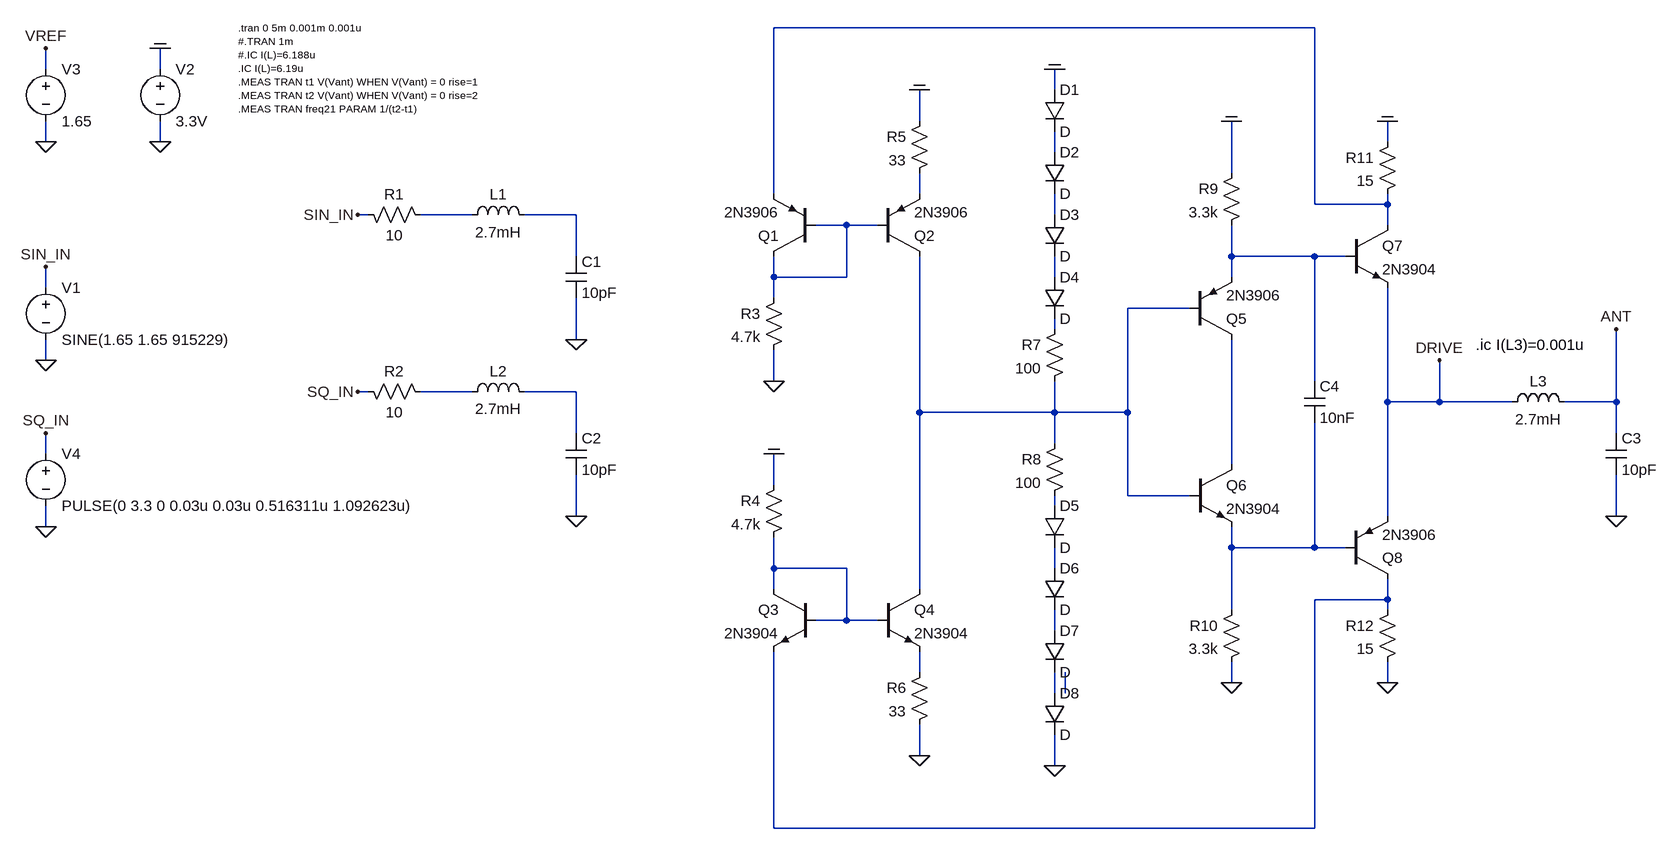
[diagram p0: schematic 2021_current_sensing_current_mirrors_oscillator_03.asc]
2021_current_sensing_current_mirrors_oscillator_03.asc, the LTspice schematic file:
Version 4
SHEET 1 8068 8692
WIRE 1504 -272 672 -272
WIRE -448 -208 -448 -240
WIRE -272 -208 -272 -240
WIRE 1104 -176 1104 -208
WIRE 896 -128 896 -176
WIRE -448 -96 -448 -128
WIRE -272 -96 -272 -128
WIRE 1616 -96 1616 -128
WIRE 1104 -80 1104 -112
WIRE 1376 -48 1376 -128
WIRE 672 -16 672 -272
WIRE 896 -16 896 -48
WIRE 1504 0 1504 -272
WIRE 1616 0 1616 -16
WIRE 1616 0 1504 0
WIRE 48 16 32 16
WIRE 208 16 128 16
WIRE 368 16 288 16
WIRE 1104 16 1104 -16
WIRE 784 32 736 32
WIRE 832 32 784 32
WIRE 1616 32 1616 0
WIRE 368 80 368 16
WIRE 1376 80 1376 32
WIRE 1504 80 1376 80
WIRE 1552 80 1504 80
WIRE 672 112 672 80
WIRE 784 112 784 32
WIRE 784 112 672 112
WIRE 1104 112 1104 80
WIRE 1376 112 1376 80
WIRE -448 128 -448 96
WIRE 672 144 672 112
WIRE 1312 160 1216 160
WIRE 1104 192 1104 176
WIRE 368 208 368 144
WIRE -448 240 -448 208
WIRE 672 272 672 224
WIRE 1504 272 1504 80
WIRE 48 288 32 288
WIRE 208 288 128 288
WIRE 368 288 288 288
WIRE 1616 304 1616 128
WIRE 1696 304 1696 240
WIRE 1696 304 1616 304
WIRE 1808 304 1696 304
WIRE 1968 304 1968 192
WIRE 1968 304 1888 304
WIRE 896 320 896 80
WIRE 1104 320 1104 272
WIRE 1104 320 896 320
WIRE 1216 320 1216 160
WIRE 1216 320 1104 320
WIRE 368 352 368 288
WIRE 1968 352 1968 304
WIRE 1104 368 1104 320
WIRE -448 384 -448 352
WIRE 1376 400 1376 208
WIRE 672 432 672 384
WIRE 1216 448 1216 320
WIRE 1312 448 1216 448
WIRE 1104 464 1104 448
WIRE 368 480 368 416
WIRE 1616 480 1616 304
WIRE 1968 480 1968 416
WIRE -448 496 -448 464
WIRE 1376 528 1376 496
WIRE 1504 528 1504 336
WIRE 1504 528 1376 528
WIRE 1552 528 1504 528
WIRE 672 560 672 512
WIRE 784 560 672 560
WIRE 1104 560 1104 528
WIRE 672 592 672 560
WIRE 896 592 896 320
WIRE 1616 608 1616 576
WIRE 1616 608 1504 608
WIRE 1376 624 1376 528
WIRE 1616 624 1616 608
WIRE 784 640 784 560
WIRE 784 640 736 640
WIRE 832 640 784 640
WIRE 1104 656 1104 624
WIRE 896 720 896 688
WIRE 1376 736 1376 704
WIRE 1616 736 1616 704
WIRE 1104 752 1104 720
WIRE 1120 752 1120 720
WIRE 896 848 896 800
WIRE 1104 864 1104 816
WIRE 672 960 672 688
WIRE 1504 960 1504 608
WIRE 1504 960 672 960
FLAG -448 240 0
FLAG 368 208 0
FLAG -272 -96 0
FLAG -272 -240 COM
FLAG -448 -96 0
FLAG -448 -240 VREF
FLAG -448 96 SIN_IN
FLAG 32 16 SIN_IN
FLAG -448 496 0
FLAG -448 352 SQ_IN
FLAG 368 480 0
FLAG 32 288 SQ_IN
FLAG 672 384 COM
FLAG 672 272 0
FLAG 896 848 0
FLAG 896 -176 COM
FLAG 1376 736 0
FLAG 1376 -128 COM
FLAG 1616 -128 COM
FLAG 1616 736 0
FLAG 1968 480 0
FLAG 1104 864 0
FLAG 1104 -208 COM
FLAG 1696 240 DRIVE
FLAG 1968 192 ANT
SYMBOL voltage -448 112 R0
WINDOW 123 0 0 Left 0
WINDOW 39 0 0 Left 0
SYMATTR InstName V1
SYMATTR Value SINE(1.65 1.65 915229)
SYMBOL ind 192 32 R270
WINDOW 0 32 56 VTop 2
WINDOW 3 5 56 VBottom 2
SYMATTR InstName L1
SYMATTR Value 2.7mH
SYMATTR SpiceLine Rser=120 Cpar=1.2pF
SYMBOL cap 352 80 R0
SYMATTR InstName C1
SYMATTR Value 10pF
SYMBOL res 144 32 M270
WINDOW 0 32 56 VTop 2
WINDOW 3 0 56 VBottom 2
SYMATTR InstName R1
SYMATTR Value 10
SYMBOL voltage -272 -224 R0
WINDOW 123 0 0 Left 2
WINDOW 39 0 0 Left 2
SYMATTR InstName V2
SYMATTR Value 3.3V
SYMBOL voltage -448 -224 R0
WINDOW 123 0 0 Left 0
WINDOW 39 0 0 Left 0
SYMATTR InstName V3
SYMATTR Value 1.65
SYMBOL voltage -448 368 R0
WINDOW 123 0 0 Left 0
WINDOW 39 0 0 Left 0
SYMATTR InstName V4
SYMATTR Value PULSE(0 3.3 0 0.03u 0.03u 0.516311u 1.092623u)
SYMBOL ind 192 304 R270
WINDOW 0 32 56 VTop 2
WINDOW 3 5 56 VBottom 2
SYMATTR InstName L2
SYMATTR Value 2.7mH
SYMATTR SpiceLine Rser=120 Cpar=1.2pF
SYMBOL cap 352 352 R0
SYMATTR InstName C2
SYMATTR Value 10pF
SYMBOL res 144 304 M270
WINDOW 0 32 56 VTop 2
WINDOW 3 0 56 VBottom 2
SYMATTR InstName R2
SYMATTR Value 10
SYMBOL npn 832 592 R0
SYMATTR InstName Q4
SYMATTR Value 2N3904
SYMBOL npn 736 592 M0
SYMATTR InstName Q3
SYMATTR Value 2N3904
SYMBOL pnp 832 80 M180
SYMATTR InstName Q2
SYMATTR Value 2N3906
SYMBOL pnp 736 80 R180
SYMATTR InstName Q1
SYMATTR Value 2N3906
SYMBOL res 688 128 M0
WINDOW 0 36 40 Left 2
WINDOW 3 36 76 Left 2
SYMATTR InstName R3
SYMATTR Value 4.7k
SYMBOL res 688 416 M0
WINDOW 0 36 40 Left 2
WINDOW 3 36 76 Left 2
SYMATTR InstName R4
SYMATTR Value 4.7k
SYMBOL res 912 704 M0
WINDOW 0 36 40 Left 2
WINDOW 3 36 76 Left 2
SYMATTR InstName R6
SYMATTR Value 33
SYMBOL res 912 -144 M0
WINDOW 0 36 40 Left 2
WINDOW 3 36 76 Left 2
SYMATTR InstName R5
SYMATTR Value 33
SYMBOL npn 1312 400 R0
SYMATTR InstName Q6
SYMATTR Value 2N3904
SYMBOL res 1392 608 M0
WINDOW 0 36 40 Left 2
WINDOW 3 36 76 Left 2
SYMATTR InstName R10
SYMATTR Value 3.3k
SYMBOL pnp 1312 208 M180
SYMATTR InstName Q5
SYMATTR Value 2N3906
SYMBOL res 1392 -64 M0
WINDOW 0 36 40 Left 2
WINDOW 3 36 76 Left 2
SYMATTR InstName R9
SYMATTR Value 3.3k
SYMBOL npn 1552 32 R0
SYMATTR InstName Q7
SYMATTR Value 2N3904
SYMBOL pnp 1552 576 M180
SYMATTR InstName Q8
SYMATTR Value 2N3906
SYMBOL res 1632 -112 M0
WINDOW 0 36 40 Left 2
WINDOW 3 36 76 Left 2
SYMATTR InstName R11
SYMATTR Value 15
SYMBOL res 1632 608 M0
WINDOW 0 36 40 Left 2
WINDOW 3 36 76 Left 2
SYMATTR InstName R12
SYMATTR Value 15
SYMBOL ind 1792 320 R270
WINDOW 0 32 56 VTop 2
WINDOW 3 5 56 VBottom 2
SYMATTR InstName L3
SYMATTR Value 2.7mH
SYMATTR SpiceLine Rser=60 Cpar=1.2pF
SYMBOL cap 1952 352 R0
SYMATTR InstName C3
SYMATTR Value 10pF
SYMBOL cap 1488 272 R0
SYMATTR InstName C4
SYMATTR Value 10nF
SYMBOL diode 1088 464 R0
SYMATTR InstName D5
SYMBOL diode 1088 560 R0
SYMATTR InstName D6
SYMBOL diode 1088 656 R0
SYMATTR InstName D7
SYMBOL res 1120 352 M0
WINDOW 0 36 40 Left 2
WINDOW 3 36 76 Left 2
SYMATTR InstName R8
SYMATTR Value 100
SYMBOL res 1120 176 M0
WINDOW 0 36 40 Left 2
WINDOW 3 36 76 Left 2
SYMATTR InstName R7
SYMATTR Value 100
SYMBOL diode 1088 -176 R0
SYMATTR InstName D1
SYMBOL diode 1088 16 R0
SYMATTR InstName D3
SYMBOL diode 1088 112 R0
SYMATTR InstName D4
SYMBOL diode 1088 -80 R0
SYMATTR InstName D2
SYMBOL diode 1088 752 R0
SYMATTR InstName D8
TEXT -152 -272 Left 1 !.tran 0 5m 0.001m 0.001u\n#.TRAN 1m\n#.IC I(L)=6.188u\n.IC I(L)=6.19u\n.MEAS TRAN t1 V(Vant) WHEN V(Vant) = 0 rise=1\n.MEAS TRAN t2 V(Vant) WHEN V(Vant) = 0 rise=2\n.MEAS TRAN freq21 PARAM 1/(t2-t1)
TEXT 1752 216 Left 2 !.ic I(L3)=0.001u

The netlist it stands for:
* 2021_current_sensing_current_mirrors_oscillator_03.asc
V1 SIN_IN 0 SINE(1.65 1.65 915229)
L1 N004 N005 2.7mH Rser=120 Cpar=1.2pF
C1 N005 0 10pF
R1 N004 SIN_IN 10
V2 COM 0 3.3V
V3 VREF 0 1.65
V4 SQ_IN 0 PULSE(0 3.3 0 0.03u 0.03u 0.516311u 1.092623u)
L2 N012 N013 2.7mH Rser=120 Cpar=1.2pF
C2 N013 0 10pF
R2 N012 SQ_IN 10
Q4 N010 N017 N021 0 2N3904
Q3 N017 N017 N019 0 2N3904
Q2 N010 N007 N003 0 2N3906
Q1 N007 N007 N001 0 2N3906
R3 N007 0 4.7k
R4 COM N017 4.7k
R6 N021 0 33
R5 COM N003 33
Q6 N014 N010 N016 0 2N3904
R10 N016 0 3.3k
Q5 N014 N010 N008 0 2N3906
R9 COM N008 3.3k
Q7 N001 N008 DRIVE 0 2N3904
Q8 N019 N016 DRIVE 0 2N3906
R11 COM N001 15
R12 N019 0 15
L3 DRIVE ANT 2.7mH Rser=60 Cpar=1.2pF
C3 ANT 0 10pF
C4 N008 N016 10nF
D5 N015 N018 D
D6 N018 N020 D
D7 N020 N022 D
R8 N010 N015 100
R7 N011 N010 100
D1 COM N002 D
D3 N006 N009 D
D4 N009 N011 D
D2 N002 N006 D
D8 N022 0 D
.model D D
.lib standard.dio
.model NPN NPN
.model PNP PNP
.lib standard.bjt
.tran 0 5m 0.001m 0.001u
#.TRAN 1m
#.IC I(L)=6.188u
.IC I(L)=6.19u
.MEAS TRAN t1 V(Vant) WHEN V(Vant) = 0 rise=1
.MEAS TRAN t2 V(Vant) WHEN V(Vant) = 0 rise=2
.MEAS TRAN freq21 PARAM 1/(t2-t1)
.ic I(L3)=0.001u
.backanno
.end